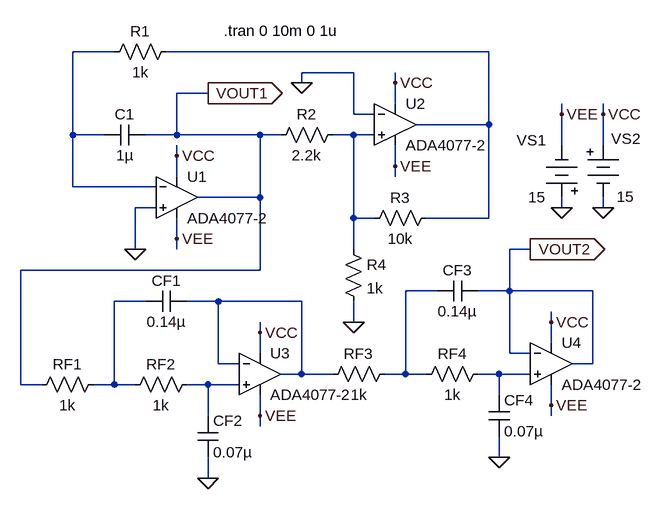
[diagram p0: schematic fig-01-03-08.asc]
fig-01-03-08.asc, the LTspice schematic file:
Version 4
SHEET 1 988 836
WIRE 112 -48 48 -48
WIRE 688 -48 192 -48
WIRE 480 -16 400 -16
WIRE 400 0 400 -16
WIRE 544 0 544 -16
WIRE 256 16 208 16
WIRE 544 32 544 0
WIRE 480 48 480 -16
WIRE 512 48 480 48
WIRE 800 48 800 32
WIRE 864 48 864 32
WIRE 688 64 688 -48
WIRE 688 64 576 64
WIRE 48 80 48 -48
WIRE 96 80 48 80
WIRE 208 80 208 16
WIRE 208 80 160 80
WIRE 336 80 208 80
WIRE 368 80 336 80
WIRE 480 80 448 80
WIRE 512 80 480 80
WIRE 800 96 800 48
WIRE 864 96 864 48
WIRE 208 112 208 96
WIRE 544 128 544 96
WIRE 208 144 208 112
WIRE 544 144 544 128
WIRE 48 160 48 80
WIRE 176 160 48 160
WIRE 336 176 336 80
WIRE 336 176 240 176
WIRE 176 192 144 192
WIRE 800 192 800 176
WIRE 864 192 864 176
WIRE 480 208 480 80
WIRE 512 208 480 208
WIRE 688 208 688 64
WIRE 688 208 592 208
WIRE 208 240 208 208
WIRE 144 256 144 192
WIRE 208 256 208 240
WIRE 480 256 480 208
WIRE 752 256 720 256
WIRE 336 288 336 176
WIRE 336 288 -32 288
WIRE 608 320 560 320
WIRE 720 320 720 256
WIRE 720 320 672 320
WIRE 848 320 720 320
WIRE 160 336 112 336
WIRE 272 336 224 336
WIRE 400 336 272 336
WIRE 480 368 480 336
WIRE 784 368 784 352
WIRE 336 384 336 368
WIRE 784 400 784 368
WIRE 336 416 336 384
WIRE 720 416 720 320
WIRE 752 416 720 416
WIRE 272 432 272 336
WIRE 304 432 272 432
WIRE 848 432 848 320
WIRE 848 432 816 432
WIRE 400 448 400 336
WIRE 400 448 368 448
WIRE 448 448 400 448
WIRE 560 448 560 320
WIRE 560 448 528 448
WIRE 592 448 560 448
WIRE 704 448 672 448
WIRE 752 448 704 448
WIRE -32 464 -32 288
WIRE 0 464 -32 464
WIRE 112 464 112 336
WIRE 112 464 80 464
WIRE 144 464 112 464
WIRE 256 464 224 464
WIRE 304 464 256 464
WIRE 704 480 704 448
WIRE 784 496 784 464
WIRE 256 512 256 464
WIRE 336 512 336 480
WIRE 784 512 784 496
WIRE 336 528 336 512
WIRE 704 576 704 544
WIRE 256 608 256 576
FLAG 256 16 VOUT1
IOPIN 256 16 Out
FLAG 800 192 0
FLAG 864 192 0
FLAG 800 48 VEE
FLAG 864 48 VCC
FLAG 208 112 VCC
FLAG 208 240 VEE
FLAG 144 256 0
FLAG 544 0 VCC
FLAG 544 128 VEE
FLAG 400 0 0
FLAG 480 368 0
FLAG 336 384 VCC
FLAG 336 512 VEE
FLAG 256 608 0
FLAG 784 368 VCC
FLAG 784 496 VEE
FLAG 704 576 0
FLAG 752 256 VOUT2
IOPIN 752 256 Out
SYMBOL res 464 64 R90
WINDOW 0 0 56 VBottom 2
WINDOW 3 32 56 VTop 2
SYMATTR InstName R2
SYMATTR Value 2.2k
SYMBOL res 608 192 R90
WINDOW 0 0 56 VBottom 2
WINDOW 3 32 56 VTop 2
SYMATTR InstName R3
SYMATTR Value 10k
SYMBOL res 208 -64 R90
WINDOW 0 0 56 VBottom 2
WINDOW 3 32 56 VTop 2
SYMATTR InstName R1
SYMATTR Value 1k
SYMBOL cap 96 96 R270
WINDOW 0 32 32 VTop 2
WINDOW 3 0 32 VBottom 2
SYMATTR InstName C1
SYMATTR Value 1µ
SYMBOL Misc\\battery 864 80 R0
WINDOW 0 12 6 Left 2
WINDOW 3 21 95 Left 2
SYMATTR InstName VS2
SYMATTR Value 15
SYMBOL Misc\\battery 800 192 R180
WINDOW 0 24 104 Left 2
WINDOW 3 24 16 Left 2
SYMATTR InstName VS1
SYMATTR Value 15
SYMBOL res 464 240 R0
SYMATTR InstName R4
SYMATTR Value 1k
SYMBOL res 240 448 R90
WINDOW 0 0 56 VBottom 2
WINDOW 3 32 56 VTop 2
SYMATTR InstName RF2
SYMATTR Value 1k
SYMBOL res 544 432 R90
WINDOW 0 0 56 VBottom 2
WINDOW 3 32 56 VTop 2
SYMATTR InstName RF3
SYMATTR Value 1k
SYMBOL res 96 448 R90
WINDOW 0 0 56 VBottom 2
WINDOW 3 32 56 VTop 2
SYMATTR InstName RF1
SYMATTR Value 1k
SYMBOL cap 224 320 R90
WINDOW 0 0 32 VBottom 2
WINDOW 3 32 32 VTop 2
SYMATTR InstName CF1
SYMATTR Value 0.14µ
SYMBOL res 688 432 R90
WINDOW 0 0 56 VBottom 2
WINDOW 3 32 56 VTop 2
SYMATTR InstName RF4
SYMATTR Value 1k
SYMBOL cap 240 512 R0
SYMATTR InstName CF2
SYMATTR Value 0.07µ
SYMBOL cap 672 304 R90
WINDOW 0 0 32 VBottom 2
WINDOW 3 32 32 VTop 2
SYMATTR InstName CF3
SYMATTR Value 0.14µ
SYMBOL cap 688 480 R0
SYMATTR InstName CF4
SYMATTR Value 0.07µ
SYMBOL Opamps\\ADA4077-2 208 112 R0
SYMATTR InstName U1
SYMBOL Opamps\\ADA4077-2 544 0 R0
SYMATTR InstName U2
SYMBOL Opamps\\ADA4077-2 336 384 R0
SYMATTR InstName U3
SYMBOL Opamps\\ADA4077-2 784 368 R0
SYMATTR InstName U4
TEXT 280 -80 Left 2 !.tran 0 10m 0 1u

The netlist it stands for:
* fig-01-03-08.asc
R2 N003 VOUT1 2.2k
R3 N002 N003 10k
R1 N002 N001 1k
C1 N001 VOUT1 1µ
VS2 VCC 0 15
VS1 0 VEE 15
R4 N003 0 1k
RF2 N008 N005 1k
RF3 N004 N006 1k
RF1 N005 VOUT1 1k
CF1 N006 N005 0.14µ
RF4 N007 N004 1k
CF2 N008 0 0.07µ
CF3 VOUT2 N004 0.14µ
CF4 N007 0 0.07µ
XU1 0 N001 VCC VEE VOUT1 ADA4077-2  ; pins In+ In- V+ V- OUT
XU2 N003 0 VCC VEE N002 ADA4077-2  ; pins In+ In- V+ V- OUT
XU3 N008 N006 VCC VEE N006 ADA4077-2  ; pins In+ In- V+ V- OUT
XU4 N007 VOUT2 VCC VEE VOUT2 ADA4077-2  ; pins In+ In- V+ V- OUT
.tran 0 10m 0 1u
.backanno
.end